# EAGLE design ColorDisplay (EAGLE 7.3.0)
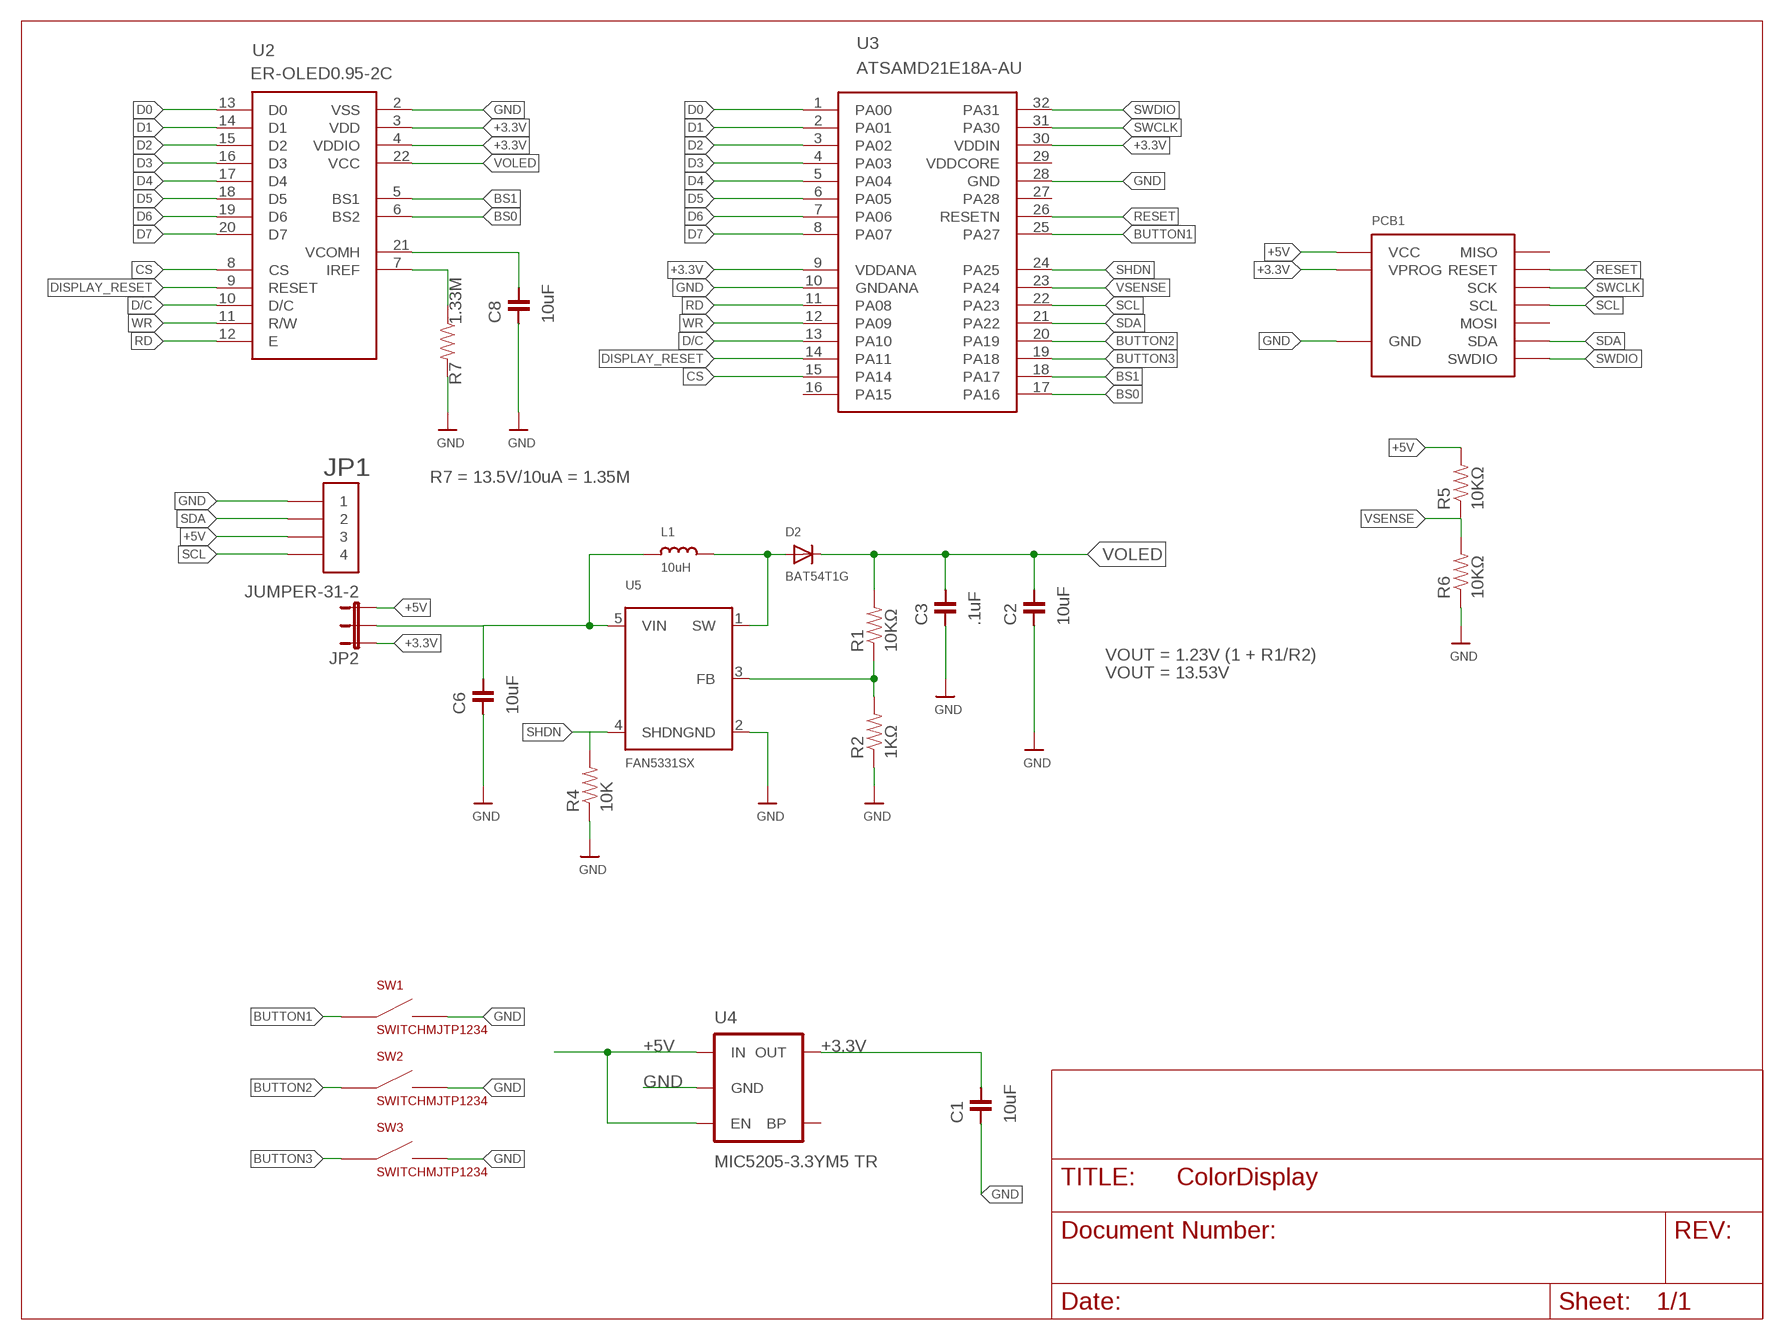
[diagram p0: schematic, sheet 1]

## Parts
C1  10uF  CAPACITOR-10UF  [0603]
C2  10uF  CAPACITOR-10UF  [0603]
C3  .1uF  CAPACITOR-.1UF  [0603]
C6  10uF  CAPACITOR-10UF  [0603]
C8  10uF  CAPACITOR-10UF  [0603]
D2  BAT54T1G  DIODESOD-123  [SOD-123]
JP1  HEADER-1X4-AMPMODU  [AMPMODU-4P]
JP2  JUMPER-31-2  [SJ_3_PASTE1&2]
L1  10uH  INDUCTOR  [INDUCTOR_1007]
PCB1  DEVICE-PCB-TABS  [DEVICE-PCB-TABS]
R1  10KΩ  RESISTOR-10KΩ  [0603]
R2  1KΩ  RESISTOR-1KΩ  [0603]
R4  10K  RESISTOR-0603  [0603]
R5  10KΩ  RESISTOR-10KΩ  [0603]
R6  10KΩ  RESISTOR-10KΩ  [0603]
R7  1.33M  RESISTOR-0603  [0603]
SW1  SWITCHMJTP1234  [MJTP1234]
SW2  SWITCHMJTP1234  [MJTP1234]
SW3  SWITCHMJTP1234  [MJTP1234]
U2  ER-OLED0.95-2C  OLED-COLORREVERSE  [FPC-24-REVERSE]
U3  ATSAMD21E18A-AU  SAMD21E  [TQFP-32]
U4  MIC5205-3.3YM5 TR  VREG-MIC5205-3.3V  [SOT23-5]
U5  FAN5331SX  FAN5331  [SOT23-5]

## Nets
+3.3V: C1.1 JP2.1 PCB1.VPROG PCB1.VPROG1(VPROG) U2.3(VDD) U2.4(VDDIO) U3.9(VDDANA) U3.30(VDDIN) U4.5(OUT)
+5V: JP1.P$5 JP1.P$6 JP2.3 PCB1.VCC PCB1.VCC1(VCC) R5.2 U4.1(IN) U4.3(EN)
BS0: U2.6(BS2) U3.17(PA16)
BS1: U2.5(BS1) U3.18(PA17)
BUTTON1: SW1.P$3(POS1) SW1.P$4(POS1) U3.25(PA27)
BUTTON2: SW2.P$3(POS1) SW2.P$4(POS1) U3.20(PA19)
BUTTON3: SW3.P$3(POS1) SW3.P$4(POS1) U3.19(PA18)
CS: U2.8(CS) U3.15(PA14)
D0: U2.13(D0) U3.1(PA00)
D1: U2.14(D1) U3.2(PA01)
D2: U2.15(D2) U3.3(PA02)
D3: U2.16(D3) U3.4(PA03)
D4: U2.17(D4) U3.5(PA04)
D5: U2.18(D5) U3.6(PA05)
D6: U2.19(D6) U3.7(PA06)
D7: U2.20(D7) U3.8(PA07)
D/C: U2.10(D/C) U3.13(PA10)
DISPLAY_RESET: U2.9(RESET) U3.14(PA11)
GND: C1.2 C2.2 C3.2 C6.2 JP1.P$1 JP1.P$2 PCB1.GND PCB1.GND1(GND) R2.1 R4.1 R6.1 R7.2 SW1.P$1(NEG1) SW1.P$2(NEG1) SW2.P$1(NEG1) SW2.P$2(NEG1) SW3.P$1(NEG1) SW3.P$2(NEG1) U2.2(VSS) U3.10(GNDANA) U3.28(GND) U4.2(GND) U5.2(GND)
N$2: D2.A L1.P$2 U5.1(SW)
N$3: R1.1 R2.2 U5.3(FB)
N$5: C8.1 U2.21(VCOMH)
N$8: R7.1 U2.7(IREF)
RD: U2.12(E) U3.11(PA08)
RESET: PCB1.RESET PCB1.RESET1(RESET) U3.26(RESETN)
SCL: JP1.P$7 JP1.P$8 PCB1.SCL PCB1.SCL1(SCL) U3.22(PA23)
SDA: JP1.P$3 JP1.P$4 PCB1.SDA PCB1.SDA1(SDA) U3.21(PA22)
SHDN: R4.2 U3.24(PA25) U5.4(SHDN)
SWCLK: PCB1.CLK1(SCK) PCB1.CLK(SCK) U3.31(PA30)
SWDIO: PCB1.SWDIO PCB1.SWDIO2(SWDIO) U3.32(PA31)
VIN: C6.1 JP2.2 L1.P$1 U5.5(VIN)
VOLED: C2.1 C3.1 D2.C R1.2 U2.22(VCC)
VSENSE: R5.1 R6.2 U3.23(PA24)
WR: U2.11(R/W) U3.12(PA09)
Unconnected: C8.2 PCB1.MISO PCB1.MISO1(MISO) PCB1.MOSI PCB1.MOSI1(MOSI) U3.16(PA15) U3.27(PA28) U3.29(VDDCORE) U4.4(BP)

## Notes on the sheet
- R7 = 13.5V/10uA = 1.35M
- VOUT = 1.23V (1 + R1/R2)
- VOUT = 13.53V

## Library data of the parts
C1 C2 C6 C8 = Modulo:CAPACITOR: Capacitor; PARTNUM: GRM188R61C106MA73D
C3 = Modulo:CAPACITOR: Capacitor; PARTNUM: C0603C104K5RACTU
D2 = microbuilder:DIODE: Diode SMA Model Volts Amps Type Vf Vr Digikey # Notes SSA34-E3 40V 3A Schottky 480mV @ 3A 200uA @ 40V SSA34-E3/61TGITR-ND CDBA120-G 20V 1A Schottky 500mV @ 1A 500uA @ 20V 641-1014-6-ND REEL MBRA210 10V 2A Schottky 350mV @ 2A 700uA @ 10V MBRA210LT3 SOD-123 Model Volts Amps Type Vf Vr Order # Notes BAT54T1G 30V 200mA Schottky 800mV @ 200mA 2uA @ 25V BAT54T1GOSTR-ND B0530W 30V 500mA Schottky 430mV @ 500mA 130uA @ 30V B0530W-FDICT-ND REEL MBR120 20V 1A Schottky 340mV @ 1A MBR120VLSFT1GOSCT-ND SOD-323 Model Volts Amps Type Vf Vr Order # Notes PMEG2005EJ 20V 500mA Schottky 355mV @ 500mA 568-4110-1-ND ZLLS410 10V 570mA Schottky 380mV @ 570mA ZLLS410CT-ND 1N4148WS 75V 150mA Silicon/Simple 1V 1N4148WSFSCT-ND REEL SOD-523 Model Volts Amps Type Vf Vr Order # Notes BAT54XV2 30V 200mA Schottky 0.8V @ 100mA BAT54XV2CT-ND TB751S 30V 30mA Schottky RB751S-40TE61CT-ND SOT23-R/W (R = Solder Paste/Reflow Ovens, W = Hand-Soldering) Model Volts Amps Type Vf Vr Order # Notes BAT54FILM 40V 300mA Schottky 497-7162-1-ND
JP1 = Modulo:HEADER-1X4; PARTNUM: 147733-3
JP2 = SparkFun-Passives:JUMPER-3
L1 = microbuilder:INDUCTOR: Inductors 0603: 10nH Ceramic Inductor - microwire antenna/RF (Digikey: 712-1434-2-ND) 0805: 560nH Ceramic Inductor - RF (Digikey: 553-1047-1-ND) 270nH Ceramic Inductor - Q = 40@250MHz, +-5%, 1 Ohm DC Resistance (Digikey: 535-10506-2-ND) 1007 (2518 Metric) SMT: 10µH 10% 250mOhm 820mA 1007 Inductor (Digikey: 587-2189-1-ND) 22µH 10% 500mOhm 580mA 1007 Inductor (Digikey: 587-2190-1-ND) 47µH 10% 950mOhm 420mA 1007 Inductor (Digikey: 587-2191-1-ND) 47µH 5% 100mOhm 1A 1008 Inductor (Digikey: 732-1816-1-ND) 5.0x5.0mm (Taiyo Yuden NR5040 Series) 6.8µH 20% 2.3A 64mOhm Inductor (Digikey: 587-2374-2-ND) 5.0x5.0mm (TDK VLC5045 Series) 4.7µH 20% 3.3A 34mOhm Inductor (Digikey: 445-6526-1-ND) 6.8µH 20% 2.7A 46mOhm Inductor (Digikey: 445-6527-1-ND) 6.0x6.0mm (TDK VLC6045 Series) 4.7µH 20% 3.8A 27mOhm Inductor (Digikey: 445-6538-2-ND) 6.8µH 20% 3A 41mOhm Inductor (Digikey: 445-6540-1-ND) 6.2µH 30% 2.2A 45mOhm Inductor (Digikey: SRR5028-6R2YCT-ND) - Not TDK VLC6045 but footprint should match 6.0x6.0mm (TDK SLF6045 Series) 6.8uH 30% 2A 33mOhm Inductor (Digikey: 445-4572-1-ND, Mouser: 810-SLF645T6R8N2R0PF) 6.0x6.0mm (Sumida CDRH5D28 Series) 6.2uH 30% 1.8A 45mOhm Inductor (Digikey: 308-1542-1-ND) Taiyo Yuden NR3015T2R2M - 2.2uH 20% 1.5A (Digikey: 587-1648-2-ND, Mouser: 963-NR3015T2R2M) - Used with TI TPS62172 CoilCraft RFID Transponder Coil - MA5532-AE (For use with AS3935 Lightning Sensor)
PCB1 = Modulo:DEVICE-PCB: Modulo Footprint; BOARD: Display; VERSION: 2
R1 R5 R6 = Modulo:RESISTOR: Resistor Basic schematic elements and footprints for 0603, 1206, and PTH resistors.; PARTNUM: ERJ-3EKF1002V
R2 = Modulo:RESISTOR: Resistor Basic schematic elements and footprints for 0603, 1206, and PTH resistors.; PARTNUM: ERJ-3EKF1001V
R4 R7 = Modulo:RESISTOR: Resistor Basic schematic elements and footprints for 0603, 1206, and PTH resistors.
SW1-SW3 = Modulo:SWITCH
U2 = Modulo:OLED-COLOR; MANUFACTURER: buydisplay.com; SUPPLIER: buydisplay.com
U3 = Modulo:SAMD21E
U4 = Modulo:VREG-MIC5205: V_REG MIC5219 Standard 3.3V and 5V 150mA LDO voltage regulator in SOT-23 layout. Micrel part MIC5205. BP (by-pass) pin is used to lower output noise with 470pF cap, may be left open.
U5 = microbuilder:FAN5331: FAN5331 - LED/OLED 20V Boost Converter Digikey: FAN5331SXCT-ND

## Board
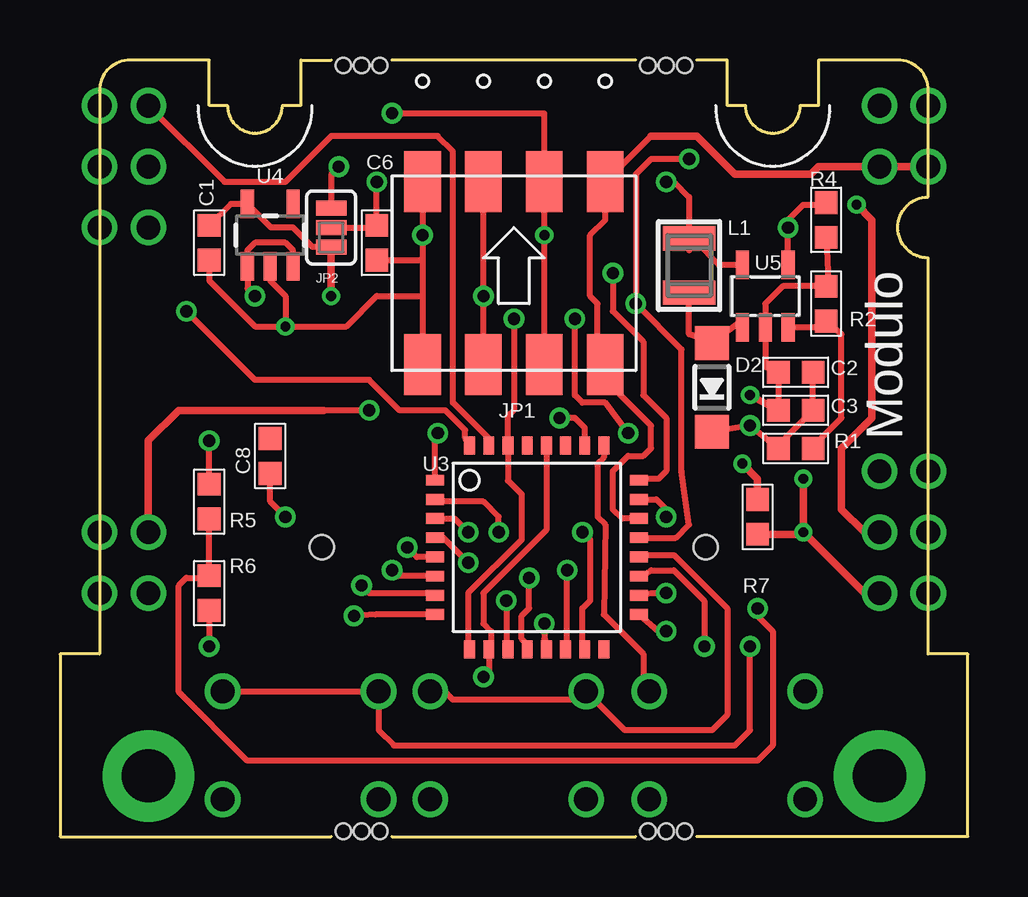
[diagram p1: board, top side]
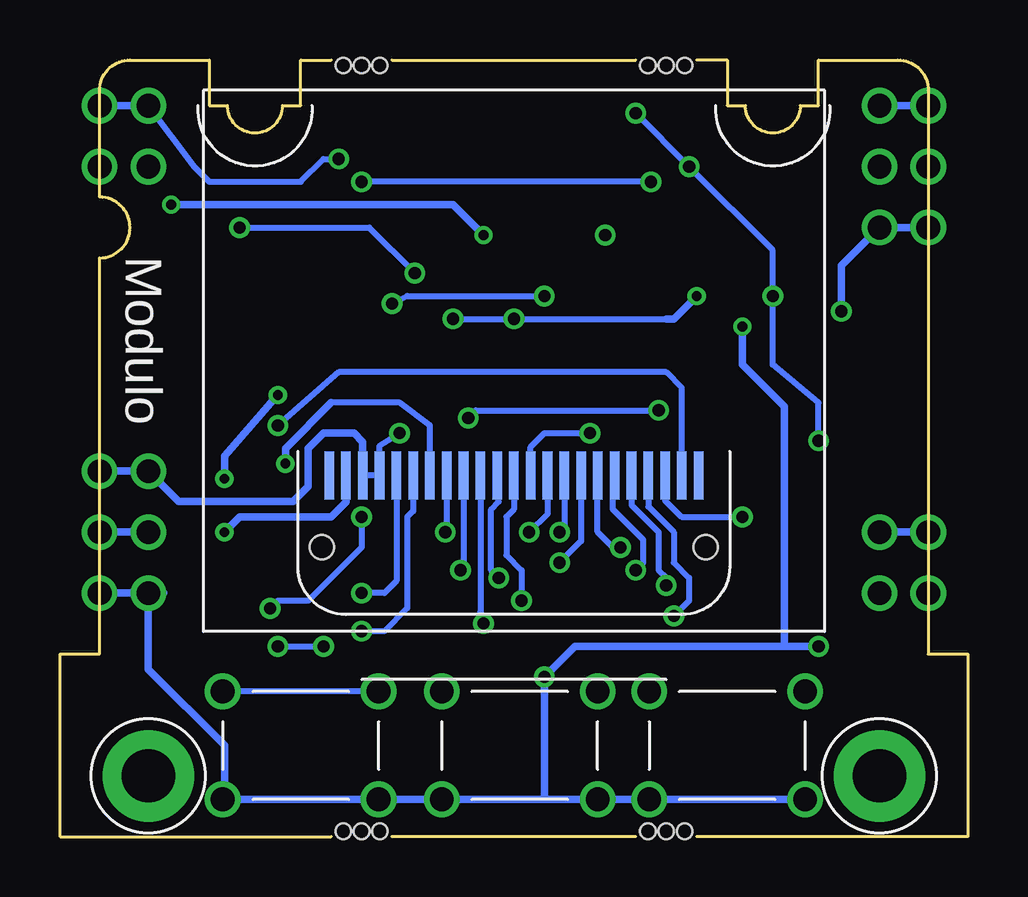
[diagram p2: board, bottom side, seen from below]

Size 37.85 x 32.38 mm. Coordinates in mm from the lower left corner, seen from the top.
Copper layers (1*16): Top 0.0356mm / dielectric 1.5011mm / Bottom 0.0356mm
Design rules "LaenPCBOrder": minimum track width 6mil, minimum drill 13mil, track to track 6mil, track to pad 6mil, pad to pad 6mil, via to via 6mil, smd to smd 6mil, copper to edge 15mil, drill to drill 6mil, minimum pad ring 7mil, minimum via ring 7mil, stop-mask expansion 3mil, vias tented up to drill 0mil, thermal gap 10mil

### Footprints (pad centres in the part's own frame; a part is rotated, then mirrored left to right if it is on the bottom)
0603 = smd 0.95 x 0.95: 1 -0.725,0; 2 0.725,0
SOD-123 = smd 1.4 x 1.4: A 1.85,0; C -1.85,0
AMPMODU-4P = smd 1.524 x 2.54: P$1 -3.81,3.81; P$2 -3.81,-3.81; P$3 -1.27,3.81; P$4 -1.27,-3.81; P$5 1.27,3.81; P$6 1.27,-3.81; P$7 3.81,3.81; P$8 3.81,-3.81
SJ_3_PASTE1&2 = smd 0.635 x 1.27: 1 -0.813,0; 2 0,0; 3 0.813,0
INDUCTOR_1007 = smd 1.016 x 2.2: P$1 -1.127,0; P$2 1.127,0
DEVICE-PCB-TABS = drill 0.991: CLK -15.24,30.48; CLK1 -17.272,30.48; GND 15.24,10.16; GND1 17.272,10.16; MISO -15.24,27.94; MISO1 -17.272,27.94; MOSI -15.24,10.16; MOSI1 -17.272,10.16; RESET -15.24,12.7; RESET1 -17.272,12.7; SCL 15.24,27.94; SCL1 17.272,27.94; SDA 15.24,30.48; SDA1 17.272,30.48; SWDIO -15.24,25.4; SWDIO2 -17.272,25.4; VCC 15.24,12.7; VCC1 17.272,12.7; VPROG 17.272,15.24; VPROG1 15.24,15.24 | drill 2.223 pad 3.81: P$1 15.24,2.54; P$2 -15.24,2.54 | hole 0.635: -5.588,32.156; -6.35,32.156; -7.112,32.156; 7.112,32.156; 6.35,32.156; 5.588,32.156; -7.112,0.229; -6.35,0.229; -5.588,0.229; 5.588,0.229; 6.35,0.229; 7.112,0.229
MJTP1234 = drill 0.991: P$1 3.25,2.25; P$2 -3.25,2.25; P$3 -3.25,-2.25; P$4 3.25,-2.25
FPC-24-REVERSE = smd 0.4 x 2: 1 7.7,1; 2 7,1; 3 6.3,1; 4 5.6,1; 5 4.9,1; 6 4.2,1; 7 3.5,1; 8 2.8,1; 9 2.1,1; 10 1.4,1; 11 0.7,1; 12 0,1; 13 -0.7,1; 14 -1.4,1; 15 -2.1,1; 16 -2.8,1; 17 -3.5,1; 18 -4.2,1; 19 -4.9,1; 20 -5.6,1; 21 -6.3,1; 22 -7,1; 23 -7.7,1 | hole 1: -8,4; 8.001,4
TQFP-32 = smd 0.75 x 0.45: 1 -4.25,2.8; 2 -4.25,2; 3 -4.25,1.2; 4 -4.25,0.4; 5 -4.25,-0.4; 6 -4.25,-1.2; 7 -4.25,-2; 8 -4.25,-2.8; 17 4.25,-2.8; 18 4.25,-2; 19 4.25,-1.2; 20 4.25,-0.4; 21 4.25,0.4; 22 4.25,1.2; 23 4.25,2; 24 4.25,2.8 | smd 0.45 x 0.75: 9 -2.8,-4.25; 10 -2,-4.25; 11 -1.2,-4.25; 12 -0.4,-4.25; 13 0.4,-4.25; 14 1.2,-4.25; 15 2,-4.25; 16 2.8,-4.25; 25 2.8,4.25; 26 2,4.25; 27 1.2,4.25; 28 0.4,4.25; 29 -0.4,4.25; 30 -1.2,4.25; 31 -2,4.25; 32 -2.8,4.25
SOT23-5 = smd 0.55 x 1.2: 1 -0.95,-1.3; 2 0,-1.3; 3 0.95,-1.3; 4 0.95,1.3; 5 -0.95,1.3

### Placement (x,y rotation side)
C1  6.22,24.77 270 top
C2  30.67,19.37 180 top
C3  30.67,17.78 180 top
C6  13.21,24.77 270 top
C8  8.76,15.88 90 top
D2  27.18,18.73 90 top
JP1  18.92,23.5 0 top
JP2  11.3,25.4 90 top
L1  26.23,23.81 270 top
PCB1  18.92,0 0 top
R1  30.67,16.19 180 top
R2  31.94,22.23 270 top
R4  31.94,25.72 90 top
R5  6.22,13.97 90 top
R6  6.22,10.16 90 top
R7  29.08,13.34 270 top
SW1  27.81,3.81 180 bottom
SW2  18.68,3.81 180 bottom
SW3  10.03,3.81 180 bottom
U2  18.92,16.07 180 bottom
U3  19.88,12.06 0 top
U4  8.76,25.08 0 top
U5  29.4,22.54 0 top

### Tracks (layer width: path | path; a pad name or v marks a point on that pad's centre or on a via)
+3.3V  (via drill 0.41, 0.51)
  Top 0.254: U3.9 17.02,7.87 17.02,10.16 19.24,12.38 19.24,14.29 18.67,14.85 U3.30 18.67,17.53 18.92,17.78 v18.92,21.59 | v23.69,16.83 22.73,18.1 21.78,18.1 21.46,18.41 v21.46,21.59 | 5.96,25.4 C1.1 7.12,26.38 U4.5 8.8,25.4 9.71,25.4 10.53,24.59 JP2.1
  Top 0.305: JP2.1 v11.3,22.54
  Bottom 0.254: 12.57,21.59 v18.92,21.59 v21.46,21.59 | U2.3 U2.4 24.52,16.31 v23.69,16.83
  Bottom 0.305: PCB1.VPROG PCB1.VPROG1 32.89,13.97 28.13,13.97 27.49,14.61 27.49,16.19 26.86,16.83 25.59,16.83 25.22,16.46 U2.3 | 12.57,21.59 12.26,21.59 v11.3,22.54
+5V  (via drill 0.41, 0.51)
  Top 0.254: JP1.P$6 v20.19,25.08 JP1.P$5 20.19,30.16 v13.84,30.16 | R5.2 v6.22,16.51 | U4.3 9.71,24.45 9.4,24.77 8.13,24.77 7.81,24.45 U4.1 7.81,22.86 v8.13,22.54 | v11.62,27.94 11.3,27.62 JP2.3
  Top 0.305: PCB1.VCC 33.53,12.7 32.58,13.65 32.58,16.19 33.85,17.46 33.85,25.72 v33.21,26.35
  Bottom 0.254: v6.22,16.51 6.22,18.1 8.13,19.68 v8.13,22.54 8.13,24.45 v11.62,27.94 v13.84,30.16
  Bottom 0.305: PCB1.VCC PCB1.VCC1 | v33.21,26.35 21.46,26.35 v20.19,25.08
BS0  (via drill 0.51)
  Top 0.254: U3.17 24.95,8.57 v25.27,8.57
  Bottom 0.254: U2.6 23.12,13.58 23.37,13.34 23.37,9.53 24.32,8.57 v25.27,8.57
BS1  (via drill 0.51)
  Top 0.254: U3.18 24.64,10.16 v25.27,10.16
  Bottom 0.254: U2.5 23.82,10.66 24.32,10.16 v25.27,10.16
BUTTON1
  Top 0.254: U3.25 22.67,15.82 22.42,15.56 22.42,13.34 22.73,13.02 22.67,9.27 24.32,7.62 24.32,6.3 SW1.P$3
  Bottom 0.254: SW1.P$3 SW1.P$4
BUTTON2
  Top 0.254: SW2.P$3 16.04,6.06 16.38,5.71 21.46,5.71 21.78,6.03 SW2.P$4 23.54,4.45 27.18,4.45 27.81,5.08 27.81,9.53 25.59,11.75 24.32,11.75 24.24,11.66 U3.20
BUTTON3  (via drill 0.51)
  Top 0.254: U3.19 24.25,10.87 24.64,11.11 25.59,11.11 26.86,9.84 v26.86,7.94 | SW3.P$3 SW3.P$4 13.28,4.45 13.92,3.81 28.13,3.81 28.76,4.45 v28.76,7.94
  Bottom 0.254: SW3.P$4 13.28,6.11 | v28.76,7.94 v26.86,7.94
CS  (via drill 0.51)
  Top 0.254: v21.78,12.7 22.1,12.38 22.1,9.84 21.78,9.53 21.78,7.94 21.88,7.84 U3.15
  Bottom 0.254: U2.8 21.72,13.07 v21.78,12.7
D0  (via drill 0.51)
  Top 0.254: U3.1 15.62,16.7 v15.75,16.83
  Bottom 0.254: U2.13 18.22,16.26 17.65,16.83 v15.75,16.83
D1  (via drill 0.51)
  Top 0.254: v18.29,12.7 18.29,13.34 17.65,13.97 15.72,13.97 U3.2
  Bottom 0.254: U2.14 17.52,13.46 v18.29,12.7
D2  (via drill 0.51)
  Top 0.254: U3.3 16.45,13.27 v17.02,12.7
  Bottom 0.254: U2.15 16.82,12.89 v17.02,12.7
D3  (via drill 0.51)
  Top 0.254: U3.4 15.98,12.46 v17.02,11.43
  Bottom 0.254: U2.16 16.12,12.32 v17.02,11.43
D4  (via drill 0.51)
  Top 0.254: U3.5 14.88,11.66 v14.48,12.06
  Bottom 0.254: v14.48,12.06 14.79,12.06 15.43,12.7 15.43,14.42 U2.17
D5  (via drill 0.51)
  Top 0.254: U3.6 14.09,10.87 v13.84,11.11
  Bottom 0.254: v13.84,11.11 13.53,11.43 13.53,12.38 14.79,13.65 14.79,14.36 U2.18
D6  (via drill 0.51)
  Top 0.254: v12.57,10.48 12.89,10.16 15.53,10.16 U3.7
  Bottom 0.254: U2.19 14.02,13.83 12.89,12.7 12.89,11.11 12.57,10.79 v12.57,10.48
D7  (via drill 0.51)
  Top 0.254: U3.8 13.15,9.27 v12.26,9.21
  Bottom 0.254: U2.20 13.32,13.77 12.26,12.7 12.26,11.43 11.62,10.79 11.62,9.84 v12.26,9.21
D/C  (via drill 0.51)
  Top 0.254: v20.19,8.89 20.19,8.26 20.28,8.02 U3.13
  Bottom 0.254: U2.10 20.32,9.39 v20.19,8.89
DISPLAY_RESET  (via drill 0.51)
  Top 0.254: U3.14 21.08,7.87 21.15,7.94 v21.15,11.11
  Bottom 0.254: U2.9 21.02,11.23 v21.15,11.11
GND  (via drill 0.41, 0.51)
  Top 0.254: 15.11,22.54 JP1.P$2 | JP1.P$1 v15.11,25.08 15.11,24.13 | 15.11,24.13 15.11,22.54 | v9.4,21.27 8.13,21.27 6.22,23.18 C1.2 | v9.4,21.27 11.94,21.27 13.21,22.54 15.11,22.54 | U3.28 20.28,12.78 17.65,10.16 17.65,8.89 17.97,8.57 17.97,7.91 U3.10 17.88,6.89 v17.65,6.67 | R4.1 32.03,23.04 R2.1 30.13,22.95 29.4,22.23 U5.2 29.4,19.59 C2.2 C3.2 | R6.1 v6.22,7.94 | C6.2 15.02,24.04 15.11,24.13 | U4.2 8.76,23.18 9.4,22.54 v9.4,21.27
  Top 0.305: C3.2 v28.76,18.41 | v30.99,12.7 v30.99,14.92 | R7.2 30.9,12.61 v30.99,12.7 | v30.99,12.7 33.53,10.16 PCB1.GND
  Bottom 0.305: v6.22,7.94 7.64,7.94 | 7.64,7.94 16.38,7.94 v17.65,6.67 17.65,1.56 | SW3.P$2 SW3.P$1 SW2.P$2 17.65,1.56 | 17.65,1.56 SW2.P$1 SW1.P$2 SW1.P$1 30.99,1.64 30.99,3.81 34.16,6.99 PCB1.GND | PCB1.GND1 PCB1.GND | PCB1.GND 33.53,10.16 | U2.2 25.92,13.96 26.54,13.34 30.35,13.34 v30.99,12.7 | v30.99,14.92 30.99,15.88 v28.76,18.41 | 7.64,7.94 7.64,17.93 9.4,19.68 v9.4,21.27
N$2
  Top 0.254: L1.P$2 26.22,20.95 D2.A 28.45,21.53 U5.1
N$3
  Top 0.254: R1.1 31.31,16.19 32.58,17.46 32.58,20.95 R2.2 31.68,21.24 U5.3
N$5  (via drill 0.51)
  Top 0.254: v9.4,13.34 8.76,13.97 C8.1
  Bottom 0.254: U2.21 12.62,14.02 11.94,13.34 v9.4,13.34
N$8  (via drill 0.41)
  Top 0.305: R7.1 29.08,14.92 v28.45,15.56
  Bottom 0.254: U2.7 22.42,17.15 23.69,18.1 26.54,18.1
  Bottom 0.305: 26.54,18.1 28.45,16.19 v28.45,15.56
RD  (via drill 0.51)
  Top 0.254: v18.6,9.84 18.6,7.88 U3.11
  Bottom 0.254: U2.12 18.92,13.65 19.24,13.34 19.24,11.75 18.6,11.11 v18.6,9.84
RESET  (via drill 0.51)
  Top 0.254: U3.26 21.88,17.05 21.46,17.46 v20.83,17.46 | v12.89,17.78 10.98,17.78
  Top 0.305: 10.98,17.78 4.95,17.78 3.68,16.51 PCB1.RESET
  Bottom 0.254: v20.83,17.46 20.51,17.78 v12.89,17.78
  Bottom 0.305: PCB1.RESET PCB1.RESET1
SCL
  Top 0.254: JP1.P$8 22.73,20.32 22.42,20.64 22.42,22.23 22.1,22.54 22.1,25.08 22.73,25.72 JP1.P$7 24.64,29.21 | 22.73,19.37 JP1.P$8 | U3.22 23.44,13.27 23.05,13.65 23.05,15.24 23.69,15.88 24.32,15.88 24.64,16.19 24.64,17.14 22.73,19.05 JP1.P$8
  Top 0.305: 24.64,29.21 26.54,29.21 28.13,27.62 31.31,27.62 31.62,27.94 PCB1.SCL PCB1.SCL1
SDA  (via drill 0.51)
  Top 0.254: JP1.P$4 v17.65,22.54 JP1.P$3 | U3.21 25.67,12.46 26.22,13.02 25.91,15.24 25.91,20.32 v24,22.23 24,27.62 24.64,28.26 v26.22,28.26
  Bottom 0.254: v24,22.23 23.37,22.54 v17.65,22.54 | PCB1.SDA 32.26,27.94 31.62,27.3 27.81,27.3 26.86,28.26 v26.22,28.26
  Bottom 0.305: PCB1.SDA PCB1.SDA1
SHDN  (via drill 0.51)
  Top 0.254: U5.4 30.35,24.13 v30.35,25.4 30.35,25.72 30.99,26.35 31.85,26.35 R4.2 | v23.05,23.5 23.05,21.91 24.32,20.64 24.32,18.41 25.27,17.46 25.27,15.24 24.95,14.92 24.18,14.92 U3.24
  Bottom 0.254: v30.35,25.4 24.95,25.4 v23.05,23.5
SWCLK
  Top 0.254: U3.31 17.88,16.61 16.38,18.1 16.38,28.57 15.75,29.21 11.3,29.21 9.4,27.3 6.86,27.3 PCB1.CLK
  Bottom 0.305: PCB1.CLK PCB1.CLK1
SWDIO  (via drill 0.51)
  Top 0.254: U3.32 16.89,16.63 16.89,16.95 16.06,17.78 14.16,17.78 12.89,19.05 8.13,19.05 v5.27,21.91
  Bottom 0.305: PCB1.SWDIO2 PCB1.SWDIO 5.27,23.81 v5.27,21.91
VIN  (via drill 0.51)
  Top 0.254: U5.5 27.46,23.84 26.54,24.77 | 26.54,24.77 26.22,25.08 26.22,26.67 25.59,27.3 v25.27,27.3 | JP2.2 13.12,25.4 C6.1 v13.21,27.3 | L1.P$1 26.22,24.45 26.54,24.77
  Bottom 0.254: v13.21,27.3 v25.27,27.3
VOLED  (via drill 0.51)
  Top 0.254: D2.C v28.76,17.14 R1.2 29.94,16.33 C3.1 C2.1
  Bottom 0.254: U2.22 11.92,18.72 12.57,19.37 26.22,19.37 v28.76,17.14
VSENSE  (via drill 0.51)
  Top 0.254: R5.1 R6.2 6.13,10.79 5.27,10.79 4.95,10.48 4.95,6.03 7.81,3.17 29.08,3.17 29.72,3.81 29.72,8.57 29.08,9.21 v29.08,9.53 | U3.23 24.86,14.06 25.27,13.65 v25.27,13.34
  Bottom 0.254: v25.27,13.34 25.27,12.06 27.49,9.84 28.76,9.84 v29.08,9.53
WR  (via drill 0.51)
  Top 0.254: U3.12 19.47,8.02 19.24,8.26 19.24,9.21 19.56,9.53 v19.56,10.79
  Bottom 0.254: v19.56,10.79 19.88,11.11 19.88,13.65 19.56,13.97 19.56,14.37 U2.11